# Altium schematic sheet VGA.SchDoc: Iris
size A3; Organization: Toradex AG; Address1: Altsagenstrasse 5; Address2: Horw; Address3: 6048; Address4: Switzerland; DocumentNumber: 11; Revision: V1.2; SheetNumber: 11; SheetTotal: 15
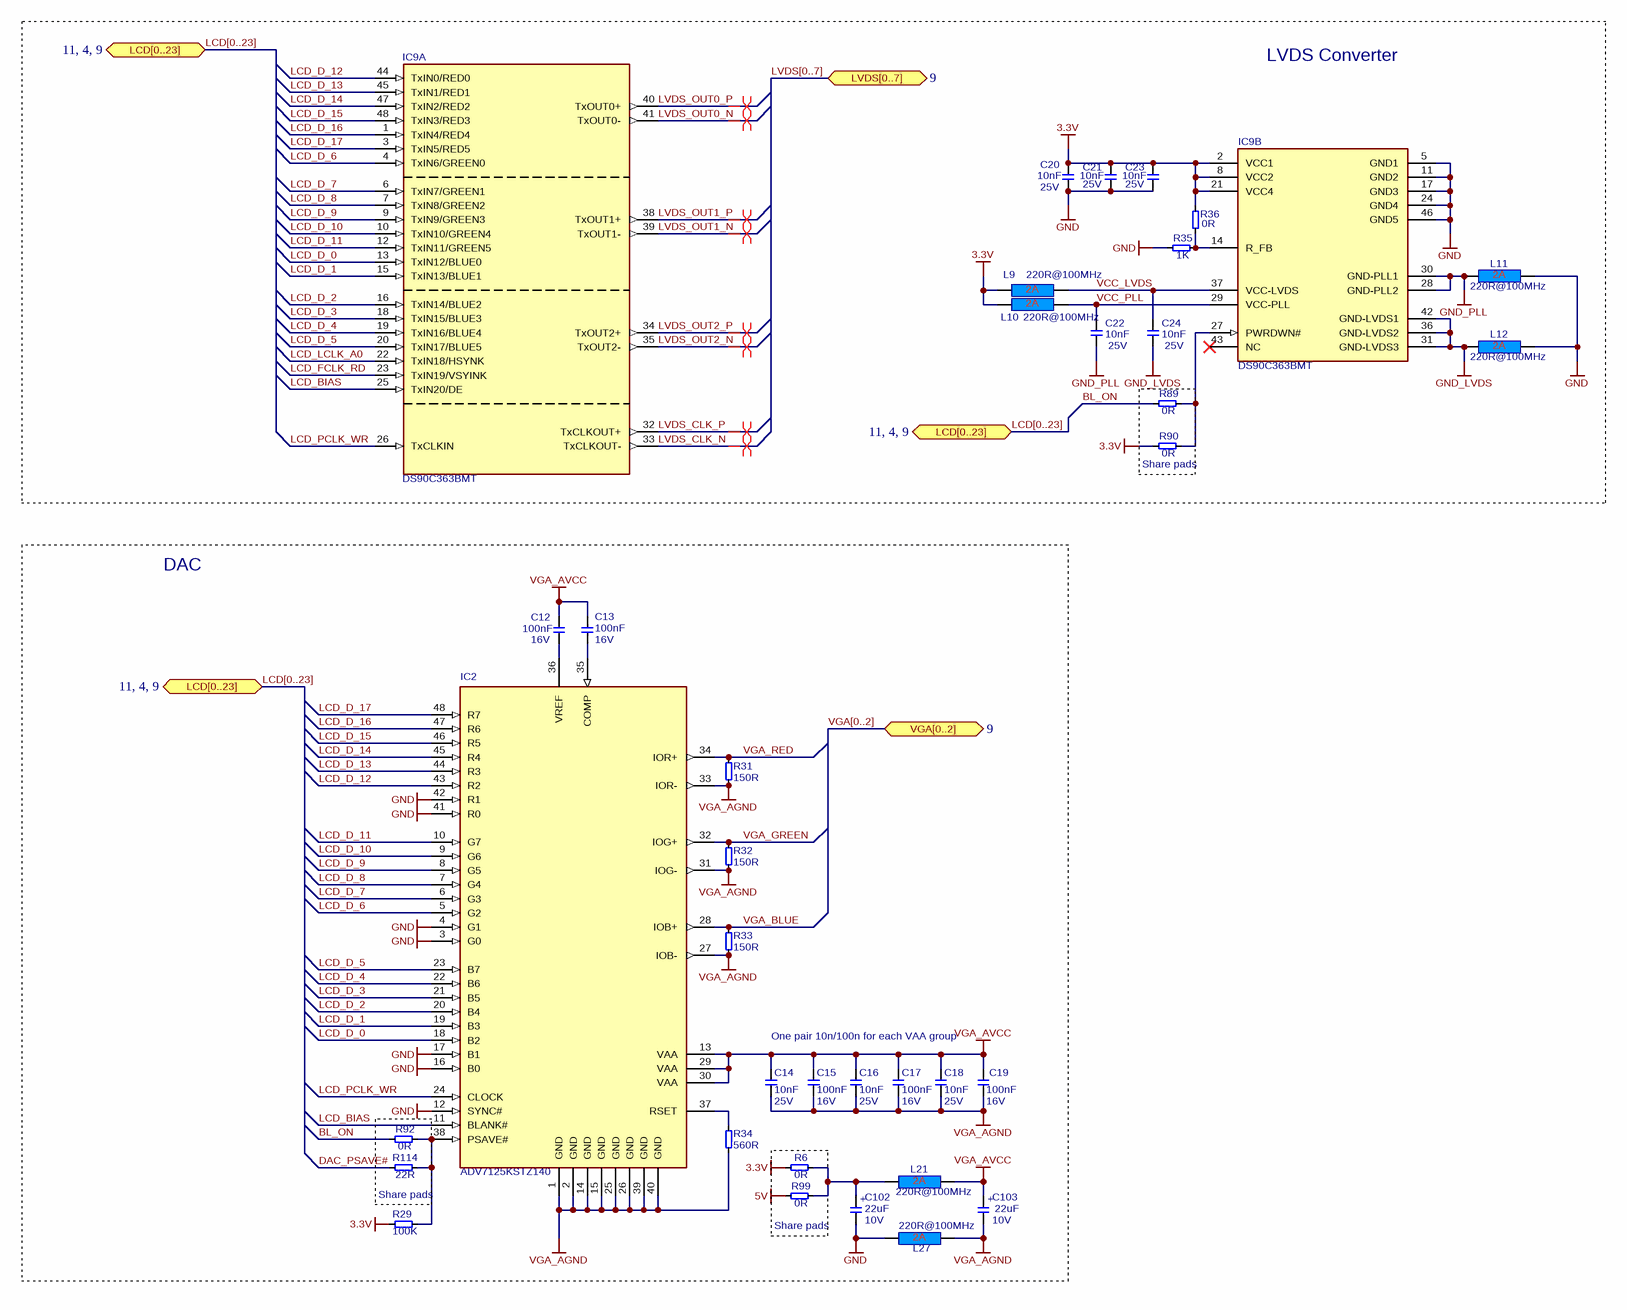
[diagram p0: VGA.SchDoc]

## Parts
C12  Rating: 16V  [T_CAPC0603X33N]  (hidden comment: 100nF)
C13  Rating: 16V  [T_CAPC0603X33N]  (hidden comment: 100nF)
C14  Rating: 25V  [T_CAPC0603X33N]  (hidden comment: 10nF)
C15  Rating: 16V  [T_CAPC0603X33N]  (hidden comment: 100nF)
C16  Rating: 25V  [T_CAPC0603X33N]  (hidden comment: 10nF)
C17  Rating: 16V  [T_CAPC0603X33N]  (hidden comment: 100nF)
C18  Rating: 25V  [T_CAPC0603X33N]  (hidden comment: 10nF)
C19  Rating: 16V  [T_CAPC0603X33N]  (hidden comment: 100nF)
C20  Rating: 25V  [T_CAPC0603X33N]  (hidden comment: 10nF)
C21  Rating: 25V  [T_CAPC0603X33N]  (hidden comment: 10nF)
C22  Rating: 25V  [T_CAPC0603X33N]  (hidden comment: 10nF)
C23  Rating: 25V  [T_CAPC0603X33N]  (hidden comment: 10nF)
C24  Rating: 25V  [T_CAPC0603X33N]  (hidden comment: 10nF)
C102  Rating: 10V  [CAPMP3528X210N]  (hidden comment: 22uF)
C103  Rating: 10V  [CAPMP3528X210N]  (hidden comment: 22uF)
IC2  ADV7125KSTZ140  [QFP50P900X900X120-48N]
IC9  DS90C363BMT  [SOP50P810X120-48N]  (parts A,B of 2)
L9  220R@100MHz  [INDC1608X95N]
L10  220R@100MHz  [INDC1608X95N]
L11  220R@100MHz  [INDC1608X95N]
L12  220R@100MHz  [INDC1608X95N]
L21  220R@100MHz  [INDC1608X95N]
L27  220R@100MHz  [INDC1608X95N]
R6  0R  [T_RESC0603X30N]
R29  100K  [T_RESC0603X30N]
R31  150R  [T_RESC0603X30N]
R32  150R  [T_RESC0603X30N]
R33  150R  [T_RESC0603X30N]
R34  560R  [t_RESC0603X30N]
R35  1K  [t_RESC0603X30N]  (no BOM)
R36  0R  [t_RESC0603X30N]
R89  0R  [t_RESC0603X30N]  (no BOM)
R90  0R  [t_RESC0603X30N]
R92  0R  [T_RESC0603X30N]  (no BOM)
R99  0R  [T_RESC0603X30N]  (no BOM)
R114  22R  [T_RESC0603X30N]

## Blocks framed on the sheet
LVDS Converter: C20-C24 IC9 L9-L12 R35 R36
Share pads: R89 R90
DAC: C12-C19 C102 C103 IC2 L21 L27 R29 R31-R34
Share pads: R92 R114
Share pads: R6 R99

## Ports
LCD[0..23] (bidir, see 11, 4, 9), LVDS[0..7] (bidir, see 9), VGA[0..2] (bidir, see 9)

## Nets
3.3V: C20.2 C21.2 C23.2 IC9.2(VCC1) IC9.8(VCC2) IC9.21(VCC4) L9.1 L10.1 R6.1 R29.1 R36.2 R90.1
5V: R99.1
GND: C20.1 C21.1 C23.1 C102.2 IC2.3(G0) IC2.4(G1) IC2.12(SYNC#) IC2.16(B0) IC2.17(B1) IC2.41(R0) IC2.42(R1) IC9.5(GND1) IC9.11(GND2) IC9.17(GND3) IC9.24(GND4) IC9.46(GND5) L11.2 L12.2 L27.1 R35.1
GND_LVDS: C24.1 IC9.31(GND-LVDS3) IC9.36(GND-LVDS2) IC9.42(GND-LVDS1) L12.1
GND_PLL: C22.1 IC9.28(GND-PLL2) IC9.30(GND-PLL1) L11.1
VGA_AGND: C14.1 C15.1 C16.1 C17.1 C18.1 C19.1 C103.2 IC2.1(GND) IC2.2(GND) IC2.14(GND) IC2.15(GND) IC2.25(GND) IC2.26(GND) IC2.27(IOB-) IC2.31(IOG-) IC2.33(IOR-) IC2.39(GND) IC2.40(GND) L27.2 R31.1 R32.1 R33.1 R34.1
VGA_AVCC: C12.2 C13.2 C14.2 C15.2 C16.2 C17.2 C18.2 C19.2 C103.1 IC2.13(VAA) IC2.29(VAA) IC2.30(VAA) L21.2
BL_ON: R89.1 R92.1
DAC_PSAVE#: R114.1
LCD_BIAS: IC2.11(BLANK#) IC9.25(TxIN20/DE)
LCD_D_0: IC2.18(B2) IC9.13(TxIN12/BLUE0)
LCD_D_1: IC2.19(B3) IC9.15(TxIN13/BLUE1)
LCD_D_2: IC2.20(B4) IC9.16(TxIN14/BLUE2)
LCD_D_3: IC2.21(B5) IC9.18(TxIN15/BLUE3)
LCD_D_4: IC2.22(B6) IC9.19(TxIN16/BLUE4)
LCD_D_5: IC2.23(B7) IC9.20(TxIN17/BLUE5)
LCD_D_6: IC2.5(G2) IC9.4(TxIN6/GREEN0)
LCD_D_7: IC2.6(G3) IC9.6(TxIN7/GREEN1)
LCD_D_8: IC2.7(G4) IC9.7(TxIN8/GREEN2)
LCD_D_9: IC2.8(G5) IC9.9(TxIN9/GREEN3)
LCD_D_10: IC2.9(G6) IC9.10(TxIN10/GREEN4)
LCD_D_11: IC2.10(G7) IC9.12(TxIN11/GREEN5)
LCD_D_12: IC2.43(R2) IC9.44(TxIN0/RED0)
LCD_D_13: IC2.44(R3) IC9.45(TxIN1/RED1)
LCD_D_14: IC2.45(R4) IC9.47(TxIN2/RED2)
LCD_D_15: IC2.46(R5) IC9.48(TxIN3/RED3)
LCD_D_16: IC2.47(R6) IC9.1(TxIN4/RED4)
LCD_D_17: IC2.48(R7) IC9.3(TxIN5/RED5)
LCD_FCLK_RD: IC9.23(TxIN19/VSYINK)
LCD_LCLK_A0: IC9.22(TxIN18/HSYNK)
LCD_PCLK_WR: IC2.24(CLOCK) IC9.26(TxCLKIN)
LVDS_CLK_N: IC9.33(TxCLKOUT-)
LVDS_CLK_P: IC9.32(TxCLKOUT+)
LVDS_OUT0_N: IC9.41(TxOUT0-)
LVDS_OUT0_P: IC9.40(TxOUT0+)
LVDS_OUT1_N: IC9.39(TxOUT1-)
LVDS_OUT1_P: IC9.38(TxOUT1+)
LVDS_OUT2_N: IC9.35(TxOUT2-)
LVDS_OUT2_P: IC9.34(TxOUT2+)
VCC_LVDS: C24.2 IC9.37(VCC-LVDS) L9.2
VCC_PLL: C22.2 IC9.29(VCC-PLL) L10.2
VGA_BLUE: IC2.28(IOB+) R33.2
VGA_GREEN: IC2.32(IOG+) R32.2
VGA_RED: IC2.34(IOR+) R31.2
NetC12_1: C12.1 IC2.36(VREF)
NetC13_1: C13.1 IC2.35(COMP)
NetC102_1: C102.1 L21.1 R6.2 R99.2
NetIC2_37: IC2.37(RSET) R34.2
NetIC2_38: IC2.38(PSAVE#) R29.2 R92.2 R114.2
NetIC9_14: IC9.14(R_FB) R35.2 R36.1
NetIC9_27: IC9.27(PWRDWN#) R89.2 R90.2

Not connected (* = marked no-connect by the designer): IC9 43(NC)*

## Buses and harness runs
bus LCD[0..23] = port LCD[0..23]
bus LVDS[0..7] = port LVDS[0..7]
bus VGA[0..2] = port VGA[0..2]

## Layout directives
differential pair: LVDS_CLK_N, LVDS_CLK_P, LVDS_OUT0_N, LVDS_OUT0_P, LVDS_OUT1_N, LVDS_OUT1_P, LVDS_OUT2_N, LVDS_OUT2_P

## Notes on the sheet
- One pair 10n/100n for each VAA group
- Title
- Size:
- Date:
- A3
- Number:
- Time:
- Revision:
- Sheet
- of
- File:
- (in symbol C-TA-22uF-10V-20%-3528) +

## Library data of the parts
C12 C13 C15 C17 C19 = C-X7R-100nF-16V-10%-0603: Capacitor Ceramic X7R 100nF 16V 10% 0603; Tolerance: 10%; Type: X7R; Value: 100nF
C14 C16 C18 C20-C24 = C-X7R-10nF-25V-10%-0603: Capacitor Ceramic X7R 10nF 25V 10% 0603; Tolerance: 10%; Type: X7R; Value: 10nF
C102 C103 = C-TA-22uF-10V-20%-3528: Capacitor TA 22uF 10V 20% 3528; Tolerance: 20%; Type: TA; Value: 22uF
IC2 = IC-AD-ADV7125KSTZ140: Video DAC 8bit 140MHz; Manufacturer Name: Analog Devices; Manufacturer Part No.: ADV7125KSTZ140
IC9 = IC-NS-DS90C363BMT: LVDS Converter; Manufacturer Name: National Semiconductor; Manufacturer Part No.: DS90C363BMT
L9-L12 L21 L27 = L-220R@100MHz-2A-25%-0603: 220R@100MHz 2A EMI FILTER; Tolerance: 25%; Rating: 2A; Value: 220R@100MHz
R6 R36 R89 R90 R92 R99 = R-0R-63mW-1%-0603: Resistor 0 ohm 63mW 1% 0603; Rating: 63mW; Tolerance: 1%; Value: 0R
R29 = R-100KR-63mW-5%-0603: Resistor 100 Kohm 63mW 5% 0603; Value: 100KR; Rating: 63mW; Tolerance: 5%
R31-R33 = R-150R-63mW-1%-0603: Resistor 150 ohm 63mW 1% 0603; Rating: 63mW; Tolerance: 1%; Value: 150R
R34 = R-560R-63mW-5%-0603: Resistor 560 ohm 63mW 5% 0603; Rating: 63mW; Tolerance: 5%; Value: 560R
R35 = R-1KR-63mW-5%-0603: Resistor 1 Kohm 63mW 5% 0603; Rating: 63mW; Tolerance: 5%; Value: 1K
R114 = R-22R-63mW-5%-0603: Resistor 22 ohm 63mW 5% 0603; Rating: 63mW; Tolerance: 5%; Value: 22R